# EAGLE design Adafruit TS2012 TPA2012 Class D Audio Amp (EAGLE 6.4)
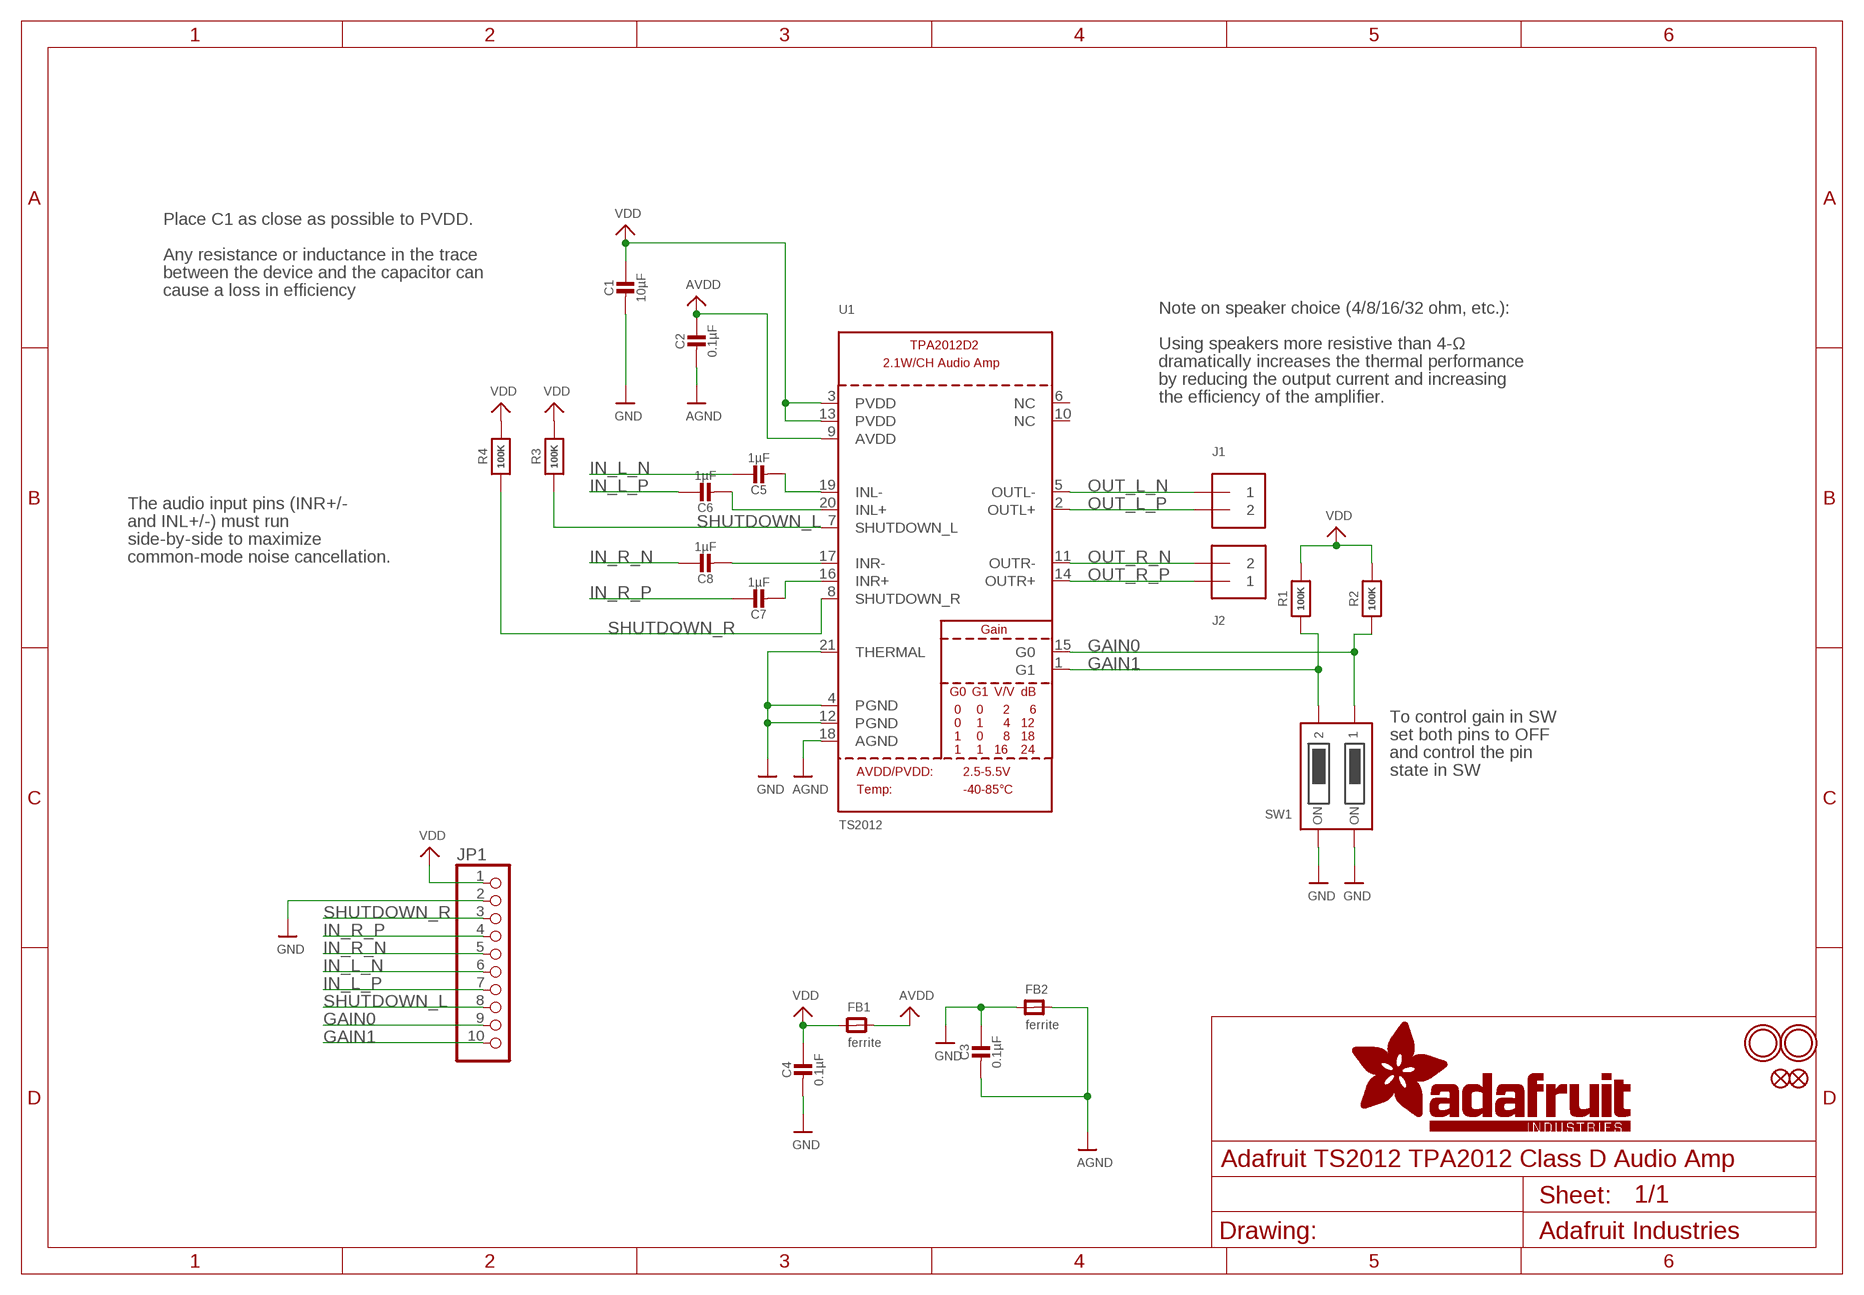
[diagram p0: schematic, sheet 1]

## Parts
C1  10µF  CAP_CERAMIC_0805MP  [_0805MP]
C2  0.1µF  CAP_CERAMIC_0805MP  [_0805MP]
C3  0.1µF  CAP_CERAMIC_0805MP  [_0805MP]
C4  0.1µF  CAP_CERAMIC_0805MP  [_0805MP]
C5  1µF  CAP_CERAMIC_0805MP  [_0805MP]
C6  1µF  CAP_CERAMIC_0805MP  [_0805MP]
C7  1µF  CAP_CERAMIC_0805MP  [_0805MP]
C8  1µF  CAP_CERAMIC_0805MP  [_0805MP]
FB1  ferrite  FERRITE_0805MP  [_0805MP]
FB2  ferrite  FERRITE_0805MP  [_0805MP]
FID1  FIDUCIAL""  [FIDUCIAL_1MM]
FID2  FIDUCIAL""  [FIDUCIAL_1MM]
J1  TERMBLOCK_1X2  [TERMBLOCK_1X2-3.5MM]
J2  TERMBLOCK_1X2  [TERMBLOCK_1X2-3.5MM]
JP1  HEADER-1X1070MIL  [1X10_ROUND70]
R1  100K  RESISTOR_0805MP  [_0805MP]
R2  100K  RESISTOR_0805MP  [_0805MP]
R3  100K  RESISTOR_0805MP  [_0805MP]
R4  100K  RESISTOR_0805MP  [_0805MP]
SW1  DIPSWITCH_2PIN  [DIPSWITCH_2PIN]
U1  TS2012  AUDIOAMP_TPA2012D2  [WQFN20]
U$20  MOUNTINGHOLE2.5_THICK  [MOUNTINGHOLE_2.5_PLATED_THICK]
U$21  MOUNTINGHOLE2.5_THICK  [MOUNTINGHOLE_2.5_PLATED_THICK]

## Nets
AGND: C2.2 C3.2 FB2.2 U1.18(AGND)
AVDD: C2.1 FB1.2 U1.9(AVDD)
GAIN0: JP1.9 R2.1 SW1.1OFF U1.15(G0)
GAIN1: JP1.10 R1.1 SW1.2OFF U1.1(G1)
GND: C1.2 C3.1 C4.2 FB2.1 JP1.2 SW1.1ON SW1.2ON U1.4(PGND) U1.12(PGND) U1.21(THERMAL)
IN_L_N: C5.1 JP1.6
IN_L_P: C6.1 JP1.7
IN_R_N: C8.1 JP1.5
IN_R_P: C7.1 JP1.4
N$1: C6.2 U1.20(INL+)
N$2: C5.2 U1.19(INL-)
N$3: C8.2 U1.17(INR-)
N$4: C7.2 U1.16(INR+)
OUT_L_N: J1.1 U1.5(OUTL-)
OUT_L_P: J1.2 U1.2(OUTL+)
OUT_R_N: J2.2 U1.11(OUTR-)
OUT_R_P: J2.1 U1.14(OUTR+)
SHUTDOWN_L: JP1.8 R3.1 U1.7(SHUTDOWN_L)
SHUTDOWN_R: JP1.3 R4.1 U1.8(SHUTDOWN_R)
VDD: C1.1 C4.1 FB1.1 JP1.1 R1.2 R2.2 R3.2 R4.2 U1.3(PVDD) U1.13(PVDD)
Unconnected: U1.6(NC) U1.10(NC)

## Notes on the sheet
- Place C1 as close as possible to PVDD.
- Any resistance or inductance in the trace
- between the device and the capacitor can
- cause a loss in efficiency
- Note on speaker choice (4/8/16/32 ohm, etc.):
- Using speakers more resistive than 4-Ω
- dramatically increases the thermal performance
- by reducing the output current and increasing
- the efficiency of the amplifier.
- The audio input pins (INR+/-
- and INL+/-) must run
- side-by-side to maximize
- common-mode noise cancellation.
- To control gain in SW
- set both pins to OFF
- and control the pin
- state in SW

## Library data of the parts
C1-C8 = microbuilder:CAP_CERAMIC: Ceramic Capacitors For new designs, use the packages preceded by an '_' character since they are more reliable: The following footprints should be used on most boards: _0402 - Standard footprint for regular board layouts _0603 - Standard footprint for regular board layouts _0805 - Standard footprint for regular board layouts _1206 - Standard footprint for regular board layouts For extremely tight-pitch boards where space is at a premium, the following 'micro-pitch' footprints can be used (smaller pads, no silkscreen outline, etc.): _0402MP - Micro-pitch footprint for very dense/compact boards _0603MP - Micro-pitch footprint for very dense/compact boards _0805MP - Micro-pitch footprint for very dense/compact boards _1206MP - Micro-pitch footprint for very dense/compact boards
FB1 FB2 = microbuilder:FERRITE: Ferrite Bead 0603 MMZ1608B121C - 120 Ohm @ 100MHz, 600mA, 0.15 Ohm DC Resistance - Digikey: 445-2164-1-ND BK1608HW121-T - 120 Ohm, 600mA Ferrite Chip - Digikey: 587-1876-2-ND 0805 HZ0805B272R-10 - 2.7K Ohm @ 100MHz, 200mA, 0.8 Ohm DC Resistance - Digikey: 240-2504-1-ND (see also Murata BLM21BD272SN1L) MMZ2012Y152B - 1.5K Ohm @ 100MHz, 500mA, 0.4 Ohm DC Resistance - Digikey: 445-1560-1-ND - Mainly for high frequency (80-400MHz) MMZ2012R102A - 1K Ohm @ 100MHz, 500mA, 0.3 Ohm DC Resistance - Digikey: 445-1555-2-ND - More general purpose (10-200MHz)
FID1 FID2 = microbuilder:FIDUCIAL: Fiducial Alignment Points Various fiducial points for machine vision alignment.; BOM: EXCLUDE
J1 J2 = microbuilder:TERMBLOCK_1X2: 3.5mm Terminal block http://www.ladyada.net/library/pcb/eaglelibrary.html
JP1 = microbuilder:HEADER-1X10: PIN HEADER
R1-R4 = microbuilder:RESISTOR: Resistors For new designs, use the packages preceded by an '_' character since they are more reliable: The following footprints should be used on most boards: _0402 - Standard footprint for regular board layouts _0603 - Standard footprint for regular board layouts _0805 - Standard footprint for regular board layouts _1206 - Standard footprint for regular board layouts For extremely tight-pitch boards where space is at a premium, the following 'micro-pitch' footprints can be used (smaller pads, no silkscreen outline, etc.): _0402MP - Micro-pitch footprint for very dense/compact boards _0603MP - Micro-pitch footprint for very dense/compact boards _0805MP - Micro-pitch footprint for very dense/compact boards _1206MP - Micro-pitch footprint for very dense/compact boards
SW1 = microbuilder:DIPSWITCH_2PIN: DIP Switch - 2 Pin - [4UConnector: 19493]
U1 = microbuilder:AUDIOAMP_TPA2012D2: TPA2012D2 2.1W/CH Stereo Class-D Audio Amp 2.1W/Ch into 4 Ohm at 5V 1.4W/Ch into 8 Ohm at 5V 720mW/Ch into 8 ohm at 3.6V Selectable Gain: 6, 12, 18 or 24 dB Power Supply (PVDD and AVDD): 2.5-5.5V Operating Temperature: -40 to 85°C Digikey (QFN20): 296-17692-1-ND
U$20 U$21 = microbuilder:MOUNTINGHOLE: Mounting Hole For #2 screws (0.086"/2.18mm width, 0.094"/2.4mm hole) use 2.5mm; BOM: EXCLUDE

## Board
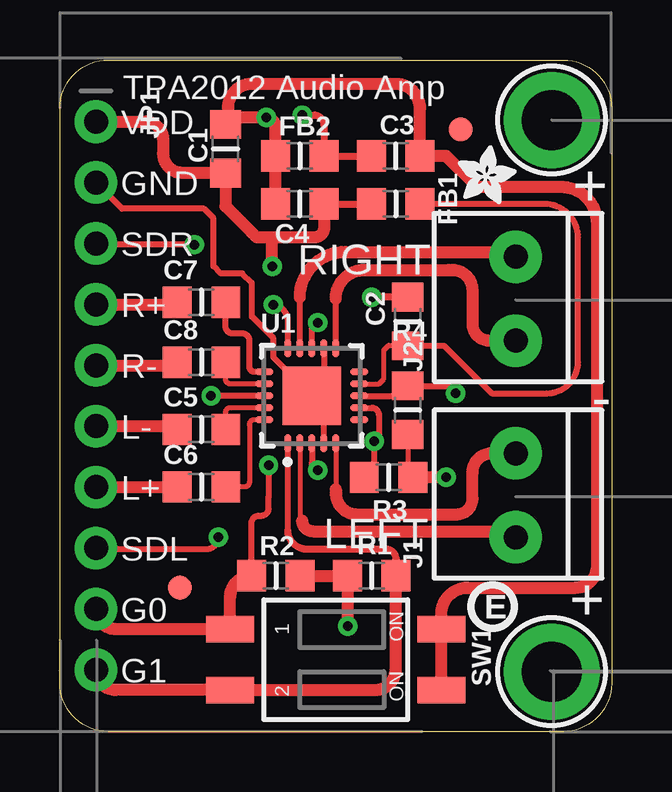
[diagram p1: board, top side]
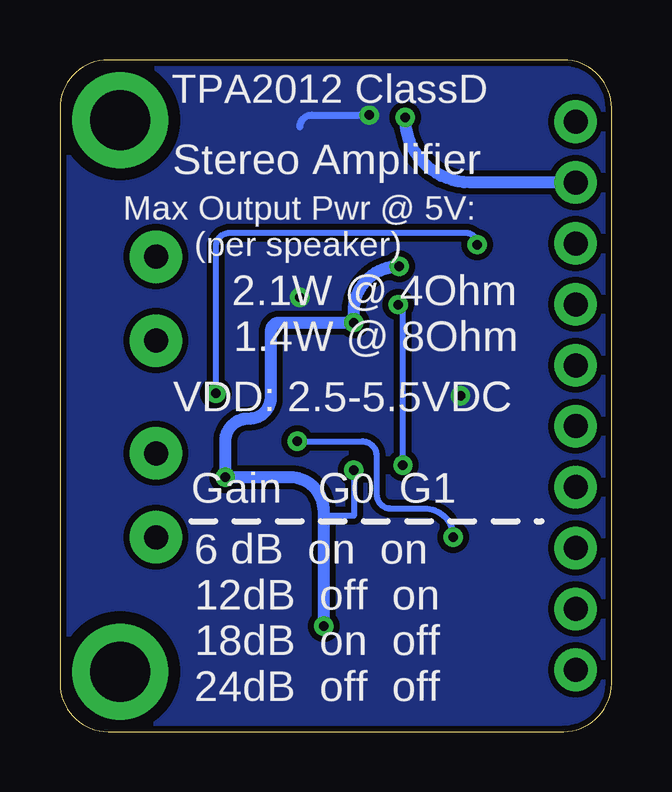
[diagram p2: board, bottom side, seen from below]

Size 23 x 28 mm. Coordinates in mm from the lower left corner, seen from the top.
Outline: 23,2 arc-90 21,0 2,0 arc-90 0,2 0,26 arc-90 2,28 21,28 arc-90 23,26 23,2
Copper layers (1*16): Top 0.035mm / dielectric 1.5mm / Bottom 0.035mm
Design rules "adafruit": minimum track width 8mil, minimum drill 15.5mil, track to track 8mil, track to pad 8mil, pad to pad 8mil, via to via 8mil, smd to smd 8mil, copper to edge 10mil, drill to drill 8mil, minimum pad ring 10mil, minimum via ring 8mil, stop-mask expansion 4mil, vias tented up to drill 20mil, thermal gap 10mil

### Footprints (pad centres in the part's own frame; a part is rotated, then mirrored left to right if it is on the bottom)
_0805MP = smd 1.2 x 1.3: 1 -1.016,0; 2 1.016,0
FIDUCIAL_1MM = smd 1 x 1: 1 0,0
TERMBLOCK_1X2-3.5MM = drill 1 pad 2.184: 1 1.8,0; 2 -1.7,0
1X10_ROUND70 = drill 1 pad 1.778: 1 -11.43,0; 2 -8.89,0; 3 -6.35,0; 4 -3.81,0; 5 -1.27,0; 6 1.27,0; 7 3.81,0; 8 6.35,0; 9 8.89,0; 10 11.43,0
DIPSWITCH_2PIN = smd 1.1 x 2: 1OFF -1.27,-4.4; 1ON -1.27,4.4; 2OFF 1.27,-4.4; 2ON 1.27,4.4
WQFN20 = smd 0.28 x 0.75: 1 -1,-1.975; 2 -0.5,-1.975; 3 0,-1.975; 4 0.5,-1.975; 5 1,-1.975; 11 1,1.975; 12 0.5,1.975; 13 0,1.975; 14 -0.5,1.975; 15 -1,1.975 | smd 0.75 x 0.28: 6 1.975,-1; 7 1.975,-0.5; 8 1.975,0; 9 1.975,0.5; 10 1.975,1; 16 -1.975,1; 17 -1.975,0.5; 18 -1.975,0; 19 -1.975,-0.5; 20 -1.975,-1 | smd 2.45 x 2.45: 21 0,0
MOUNTINGHOLE_2.5_PLATED_THICK = drill 2.5 pad 4: P$1 0,0

### Placement (x,y rotation side)
C1  6.9,24.3 90 top
C2  14.5,17.1 90 top
C3  14,24 180 top
C4  10,22 180 top
C5  5.9,12.6 0 top
C6  5.9,10.2 0 top
C7  5.9,17.9 0 top
C8  5.9,15.4 0 top
FB1  14,22 0 top
FB2  10,24 0 top
FID1  16.7,25.1 0 top
FID2  5,6 0 top
J1  19,9.8 90 top
J2  19,18 90 top
JP1  1.5,14 270 top
R1  13,6.5 180 top
R2  9,6.5 0 top
R3  13.7,10.6 0 top
R4  14.5,13.4 270 top
SW1  11.5,3 270 top
U1  10.5,14 0 top
U$20  20.5,2.5 0 top
U$21  20.5,25.5 0 top
U$22  [ADAFRUIT_2.5MM]  16.6,22 0 top
U$23  [PCBFEAT-REV-040]  18.03,5.21 0 top

### Tracks (layer width: path | path; a pad name or v marks a point on that pad's centre or on a via)
AGND  (via drill 0.39)
  Top 0.25: U1.18 v6.3,14
  Top 0.3: C3.2 FB2.2 arc-90 11,24.02 11,25.3 arc90 10.6,25.7 v10.1,25.7 | C2.2 13.02,18.12 arc90 v13,18.1
  Bottom 0.3: 13,25.2 arc90 12.5,25.7 v10.1,25.7
  pour Bottom (isolate 0.254): 0.13,0.13 0.13,28.07 22.99,27.94 22.99,0
AVDD
  Top 0.203: U1.9 13.3,14.5 13.5,14.7 13.5,15.9 13.7,16.1 14.48,16.1 C2.1
  Top 0.25: C2.1 16.02,16.08 18,14.1 20.3,14.1 arc90 21.6,15.4 21.6,20.6 arc90 20.2,22 FB1.2
GAIN0  (via drill 0.39)
  Top 0.25: v8.7,11.1 8.7,9.8 8.7,9.3 arc-90 8.4,9 8.3,9 arc90 7.98,8.68 R2.1
  Top 0.254: U1.15 9.5,17 arc90 v8.9,17.8
  Top 0.5: JP1.9 arc90 2.34,4.27 SW1.1OFF 7.1,5.62 arc-90 R2.1
  Bottom 0.25: v8.7,11.1 8.7,17.6 v8.9,17.8
GAIN1
  Top 0.25: 9.5,8.4 U1.1
  Top 0.3: R1.1 14.02,7.18 arc90 13.6,7.6 10.3,7.6 arc-90 9.5,8.4
  Top 0.5: JP1.10 arc90 2.34,1.73 SW1.2OFF 13.13,1.73 arc90 14,2.6 14,6.48 arc-90 R1.1
GND  (via drill 0.39)
  Top 0.25: U1.4 11,13.5 U1.21 10.8,14.3 10.8,14.9 | U1.12 11,15.1 10.8,14.9 | 10.8,14.9 9.6,14.9 8.9,15.6 8.9,16.4 8,17.3 8,18.6 8,18.7 7.6,19.1 6.7,19.1 6.4,19.4 6.4,21.4 6,21.8 2.59,21.8 JP1.2
  Top 0.5: C4.2 FB2.1 8.98,25.22 arc90 v8.6,25.6 7.18,25.6 arc90 C1.2 arc90 7,25.42 7,26 arc-90 8,27 14,27 arc-90 15.02,25.98 C3.1 16.1,24 17.4,22.7 20.9,22.7 arc-90 22.4,21.2 22.4,6.9 arc-90 21.5,6 17,6 arc90 15.9,4.9 SW1.1ON SW1.2ON
  Bottom 0.5: JP1.2 5.89,22.89 arc90 v8.6,25.6
IN_L_N
  Top 0.5: JP1.6 4.85,12.73 C5.1
IN_L_P
  Top 0.5: JP1.7 C6.1
IN_R_N
  Top 0.5: JP1.5 4.75,15.27 C8.1
IN_R_P
  Top 0.5: JP1.4 4.79,17.81 C7.1
N$1
  Top 0.203: U1.20 8.1,13 arc90 7.9,12.8 7.9,10.4 arc-90 7.7,10.2 C6.2
N$2
  Top 0.203: U1.19 7.1,13.5 arc90 6.9,13.3 6.9,12.62 arc90 C5.2
N$3
  Top 0.203: U1.17 7.1,14.5 arc-90 6.9,14.7 6.9,15.38 arc-90 C8.2
N$4
  Top 0.254: U1.16 8.1,15 arc-90 7.9,15.2 7.9,16.3 arc90 7.6,16.6 7.2,16.6 arc-90 6.9,16.9 6.9,17.88 arc-90 C7.2
OUT_L_N
  Top 0.203: U1.5 11.5,10.1
  Top 0.5: 11.5,10.1 11.5,9.95 arc90 12.4,9.05 16.55,9.05 arc90 17.2,9.7 17.2,10.8 arc-90 18,11.6 J1.1
OUT_L_P
  Top 0.203: U1.2 10,8.9 arc90 10.1,8.8
  Top 0.5: J1.2 arc90 18.95,8.35 10.55,8.35 arc-90 10.1,8.8
OUT_R_N
  Top 0.25: U1.11 11.5,17.65 11.5,18.05
  Top 0.5: 11.5,18.05 arc-90 12.7,19.25 16.2,19.25 16.35,19.25 arc-90 17.2,18.4 17.2,17 arc90 17.9,16.3 J2.2
OUT_R_P
  Top 0.25: U1.14 10,17.7 10,18.1
  Top 0.5: 10,18.1 arc-90 11.9,20 18.8,20 arc-90 J2.1
SHUTDOWN_L  (via drill 0.39)
  Top 0.25: U1.7 13,13.5 arc-90 13.3,13.2 13.3,12.3 arc-90 v13.1,12.1 13.1,11.02 arc-90 R3.1 | v6.6,8.1 arc-90 6.1,7.6 1.55,7.6 arc-90 JP1.8
  Bottom 0.25: v13.1,12.1 10.4,12.1 arc90 9.8,11.5 9.8,9.9 arc-90 9.2,9.3 7.8,9.3 arc90 v6.6,8.1
SHUTDOWN_R  (via drill 0.39)
  Top 0.25: v16.5,14.1 arc90 16.18,14.42 R4.1 arc-90 14.08,14 U1.8 | v5.6,20.3 1.55,20.3 arc-90 JP1.3
  Bottom 0.25: v16.5,14.1 16.5,20.2 arc90 15.9,20.8 6.1,20.8 arc90 v5.6,20.3
VDD  (via drill 0.39)
  Top 0.203: R4.2 14.5,10.82 R3.2
  Top 0.25: U1.3 10.5,11.2 arc90 v10.75,10.9 | U1.13 10.5,16.8 v10.75,17.05
  Top 0.3: C4.1 FB1.1
  Top 0.5: JP1.1 3.57,25.43 arc-90 4.3,24.7 4.3,24.1 arc90 5.1,23.3 6.88,23.3 arc-90 C1.1 6.9,21.9 8,20.8 8.2,20.6 9,20.6 | C4.1 11.02,21.02 arc-90 10.6,20.6 9,20.6 | R2.2 R1.2 11.98,4.42 arc90 v12,4.4 | v16.1,10.6 R3.2 | v8.85,19.4 8.85,20.45 arc-90 9,20.6
  Bottom 0.25: v10.75,10.9 10.75,9 12,9
  Bottom 0.5: v12,4.4 12,9 12,9.2 arc-90 13.4,10.6 v16.1,10.6 16.1,12.1 arc90 15.15,13.05 15.1,13.05 arc-90 14.2,13.95 14.2,16.7 arc90 13.85,17.05 v10.75,17.05 10.75,17.5 arc90 v8.85,19.4

### Text on the board
tPlace: TPA2012 Audio Amp | VDD | GND | + | SDR | RIGHT | R+ | R- | - | L- | L+ | LEFT | SDL | G0 | + | G1
bPlace: TPA2012 ClassD | Stereo Amplifier | Max Output Pwr @ 5V: | (per speaker) | 2.1W @ 4Ohm | 1.4W @ 8Ohm | VDD: 2.5-5.5VDC | Gain G0 G1 | 6 dB on on / 12dB off on / 18dB on off / 24dB off off